# EAGLE schematic AmpBoardSchematic (EAGLE 8.3.2)

## Sheet 1 of 2
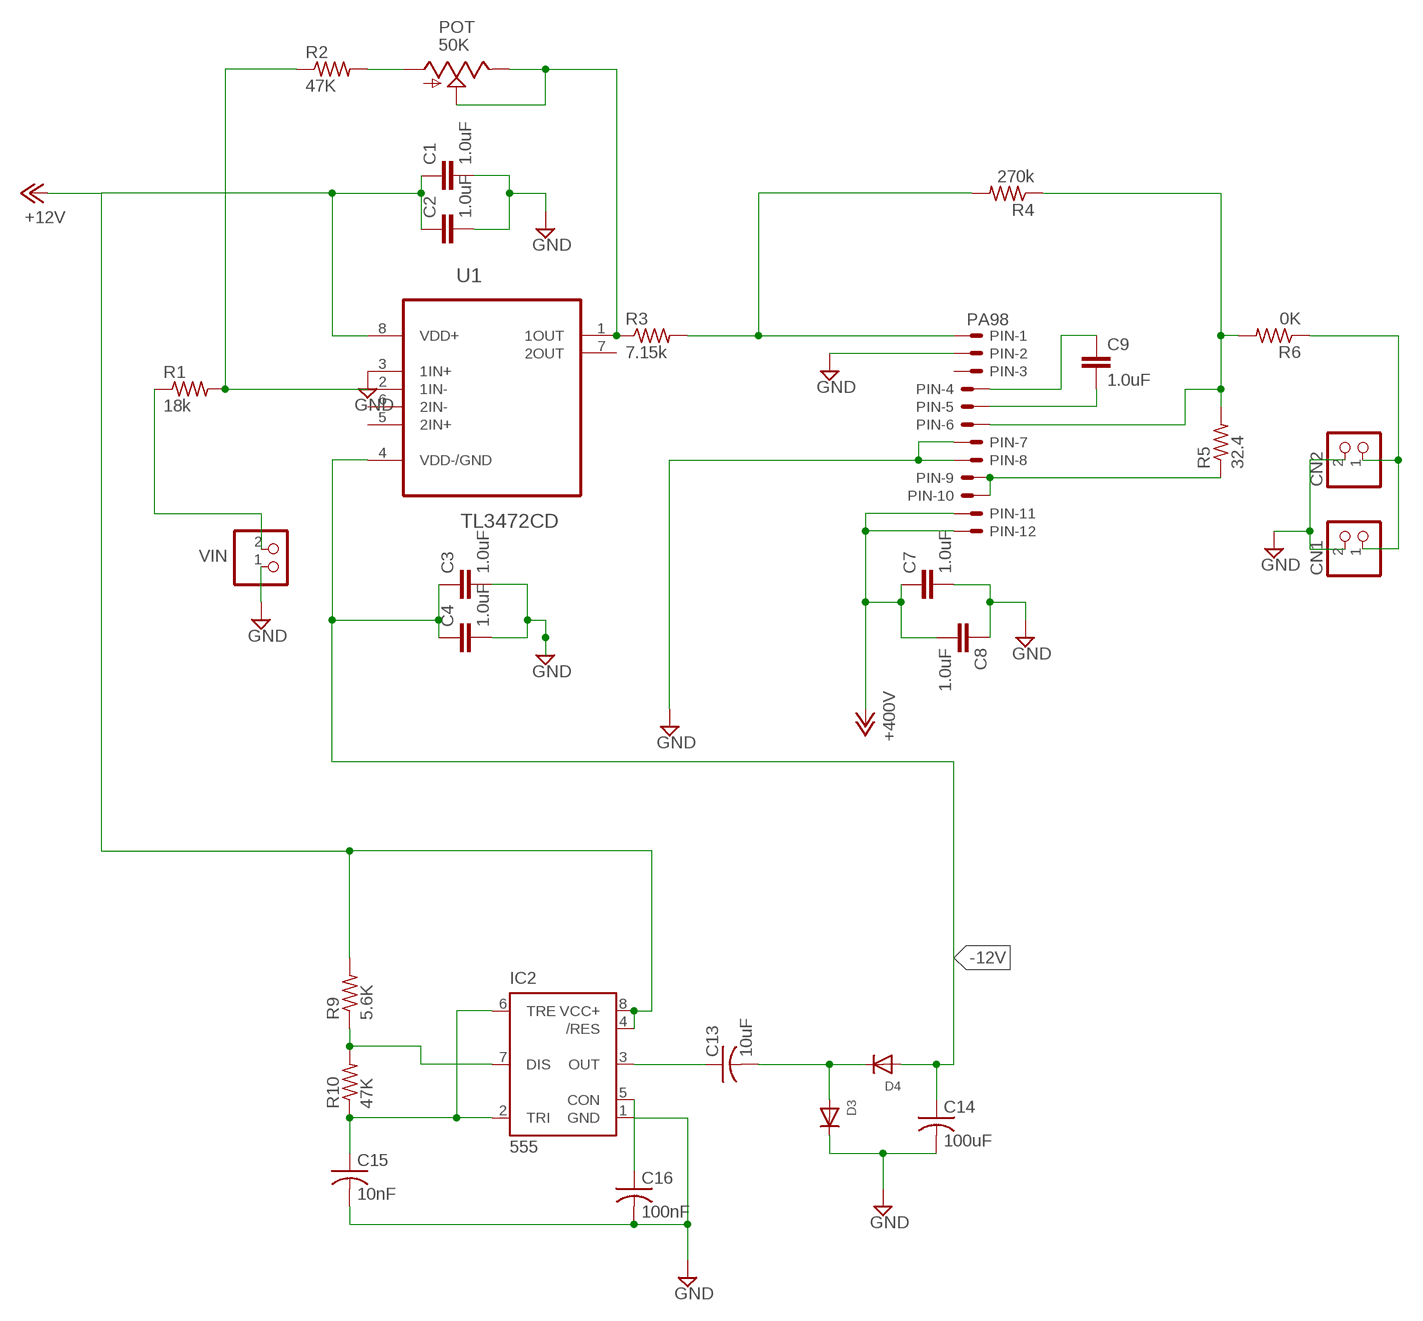
[diagram p0: schematic, sheet 1]

### Parts
C1  1.0uF  1.0UF-1206-50V-10%  [1206]
C2  1.0uF  1.0UF-1206-50V-10%  [1206]
C3  1.0uF  1.0UF-1206-50V-10%  [1206]
C4  1.0uF  1.0UF-1206-50V-10%  [1206]
C7  1.0uF  1.0UF-1206-50V-10%  [1206]
C8  1.0uF  1.0UF-1206-50V-10%  [1206]
C9  1.0uF  1.0UF-1206-50V-10%  [1206]
C13  10uF  C-USC1206  [C1206]
C14  100uF  C-USC1206  [C1206]
C15  10nF  C-USC1206  [C1206]
C16  100nF  C-USC1206  [C1206]
CN1  JST_2PIN-THM  [JST-PH-2-THM]
CN2  JST_2PIN-THM  [JST-PH-2-THM]
D3  DIODESOD-123  [SOD-123]
D4  DIODESOD-123  [SOD-123]
IC2  555  555D  [SO08]
PIN  PA98  22-23-2121  [22-23-2121]
POT  50K  TRIM_US-3223W  [3223W]
R1  18k  R-US_M1206  [M1206]
R2  47K  R-US_M1206  [M1206]
R3  7.15k  R-US_M1206  [M1206]
R4  270k  R-US_M1206  [M1206]
R5  32.4  R-US_M1206  [M1206]
R6  0K  R-US_M1206  [M1206]
R9  5.6K  R-US_M1206  [M1206]
R10  47K  R-US_M1206  [M1206]
U1  TL3472CD  [SOIC127P600X175-8N]
VIN  JST_2PIN-THM  [JST-PH-2-THM]

### Nets
+12V: C1.1 C2.1 C7.1 C8.2 IC2.4(/RES) IC2.8(VCC+) PIN.11 PIN.12 R9.2 U1.8(VDD+) ; supply symbol labelled +400V
-12V: C3.1 C4.1 C14.1 D4.A U1.4(VDD-/GND)
GND: C1.2 C2.2 C3.2 C4.2 C7.2 C8.1 C14.2 C15.2 C16.2 CN1.2 CN2.2 D3.C IC2.1(GND) PIN.2 PIN.7 PIN.8 U1.3(1IN+) VIN.1 ; also sheet 2
N$1: R1.2 R2.1 U1.2(1IN-)
N$2: POT.2(S) POT.3(E) R3.1 U1.1(1OUT)
N$3: PIN.1 R3.2 R4.2
N$4: PIN.9 PIN.10 R5.1
N$5: PIN.6 R4.1 R5.2 R6.2
N$6: C9.1 PIN.4
N$7: C9.2 PIN.5
N$9: CN1.1 CN2.1 R6.1
N$10: R1.1 VIN.2
N$17: C16.1 IC2.5(CON)
N$18: C13.1 IC2.3(OUT)
N$19: IC2.7(DIS) R9.1 R10.2
N$20: C15.1 IC2.2(TRI) IC2.6(TRE) R10.1
N$21: C13.2 D3.A D4.C
N$23: POT.1(A) R2.2
Unconnected: PIN.3 U1.5(2IN+) U1.6(2IN-) U1.7(2OUT)

## Sheet 2 of 2
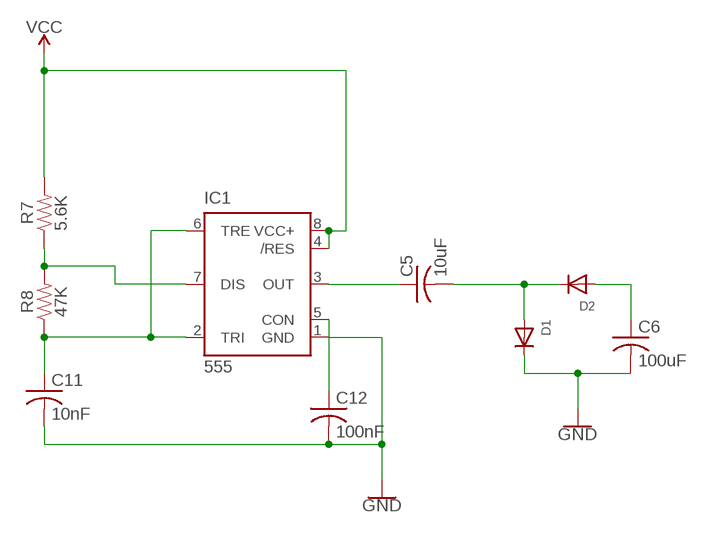
[diagram p1: schematic, sheet 2]

### Parts
C5  10uF  C-USC1206  [C1206]
C6  100uF  C-USC1206  [C1206]
C11  10nF  C-USC1206  [C1206]
C12  100nF  C-USC1206  [C1206]
D1  DIODESOD-123  [SOD-123]
D2  DIODESOD-123  [SOD-123]
IC1  555  555D  [SO08]
R7  5.6K  RESISTOR0805  [0805]
R8  47K  RESISTOR0805  [0805]

### Nets
GND: C6.2 C11.2 C12.2 D1.C IC1.1(GND) ; also sheet 1
N$11: C12.1 IC1.5(CON)
N$12: C5.1 IC1.3(OUT)
N$13: IC1.7(DIS) R7.1 R8.2
N$14: C11.1 IC1.2(TRI) IC1.6(TRE) R8.1
N$15: C5.2 D1.A D2.C
N$16: C6.1 D2.A
VCC: IC1.4(/RES) IC1.8(VCC+) R7.2

## Library data of the parts
C1 C3 C8 = SparkFun-Capacitors:1.0UF: 1µF ceramic capacitors A capacitor is a passive two-terminal electrical component used to store electrical energy temporarily in an electric field.; MF: KEMET; MPN: C0805C103K1RACTU; OC_FARNELL: 1414661; PROD_ID: CAP-09822
C2 C4 C7 = SparkFun-Capacitors:1.0UF: 1µF ceramic capacitors A capacitor is a passive two-terminal electrical component used to store electrical energy temporarily in an electric field.; MF: KEMET; MPN: C0805C104J5RACTU; OC_FARNELL: 1414663; PROD_ID: CAP-09822
C5 C6 C11-C16 = rcl:C-US: CAPACITOR, American symbol
C9 = SparkFun-Capacitors:1.0UF: 1µF ceramic capacitors A capacitor is a passive two-terminal electrical component used to store electrical energy temporarily in an electric field.; MF: KEMET; MPN: C0805C479C5GACTU; OC_FARNELL: 1800809; PROD_ID: CAP-09822
CN1 CN2 VIN = adafruit:JST_2PIN: JST 2-Pin Connectors of various flavors SMT-RA (S2B-PH-SM4) 4UConnector #17311 SMT (B2B-PH-SM4) THM-RA (S2B-PH) THM (B2B-PH); OC_FARNELL: unknown
D1-D4 = adafruit:DIODE: Diode SMADIODE - SMA Surface Mount Package 20V 1A Schottky Diode Digikey: 641-1014-6-ND DO-1N4148 - Through Hole Small Current Diode SOD-123 20V 1 A (.5mV Vf) Schottky Diode - Digikey: MBRX120TPMSCT-ND SOD-323 10V 570mA (.38mV Vf, 3ns) Schottky Diode - Digikey: ZLLS410CT-ND SOD-523 30V 30mA Schottky Diode (RB751S-40TE61) - Digikey: RB751S-40TE61CT-ND SOT23-R/W - SOT23 Package (R = Solder Paste/Reflow Ovens, W = Hand-Soldering) BAT54Film 40V 300mA - Digikey: 497-7162-1-ND
IC1 IC2 = SparkFun-IC-Special-Function:555: General purpose bipolar Timer Datasheet <http://www.sparkfun.com/datasheets/Components/General/ne555.pdf> SparkFun Products SparkFun SparkPunk Sequencer Kit <https://www.sparkfun.com/products/12707> (KIT-12707) Storefront Component: 555 Timer <https://www.sparkfun.com/products/9273> (COM-09273) Two parts valid for production: VFP: IC-11930 (M7555 PTH) VFP: IC-09173 (555 PTH) - Preferred; PROD_ID: NA-XXXXX
PIN = con-molex:22-23-2121: .100" (2.54mm) Center Header - 12 Pin; OC_FARNELL: unknown; OC_NEWARK: 56H0456
POT = pot:TRIM_US-: POTENTIOMETER
R1 = adafruit:R-US_: RESISTOR, American symbol; MF: WELWYN; MPN: WCR0805-18KFI; OC_FARNELL: 1100322
R2 = adafruit:R-US_: RESISTOR, American symbol; MF: KOA SPEAR ELECTRONICS; MPN: SG73S2ATTD9102F; OC_FARNELL: 1400374
R3 = adafruit:R-US_: RESISTOR, American symbol; MF: VISHAY; MPN: CRCW08057K15FKEA; OC_FARNELL: 1152455
R4 R6 = adafruit:R-US_: RESISTOR, American symbol; MF: WELWYN; MPN: WCR0805-270KFI; OC_FARNELL: 1100330RL
R5 = adafruit:R-US_: RESISTOR, American symbol; MF: PANASONIC ELECTRONIC COMPONENTS; MPN: ERJ8ENF32R4V; OC_FARNELL: 2307627
R7 R8 = SparkFun-Resistors:RESISTOR: Generic Resistor Package
R9 R10 = adafruit:R-US_: RESISTOR, American symbol
U1 = TL3472CD:TL3472CD: HIGH-SLEW-RATE, SINGLE-SUPPLY OPERATIONAL AMPLIFIER; AVAILABILITY: Good; DESCRIPTION: High-Slew- ate, Single-Supply Operational Amplifier 8-SOIC 0 to 70; MF: Texas Instruments; MP: TL3472CD; OC_FARNELL: unknown; PACKAGE: SOIC-8 Texas Instruments; PRICE: 0.47 USD